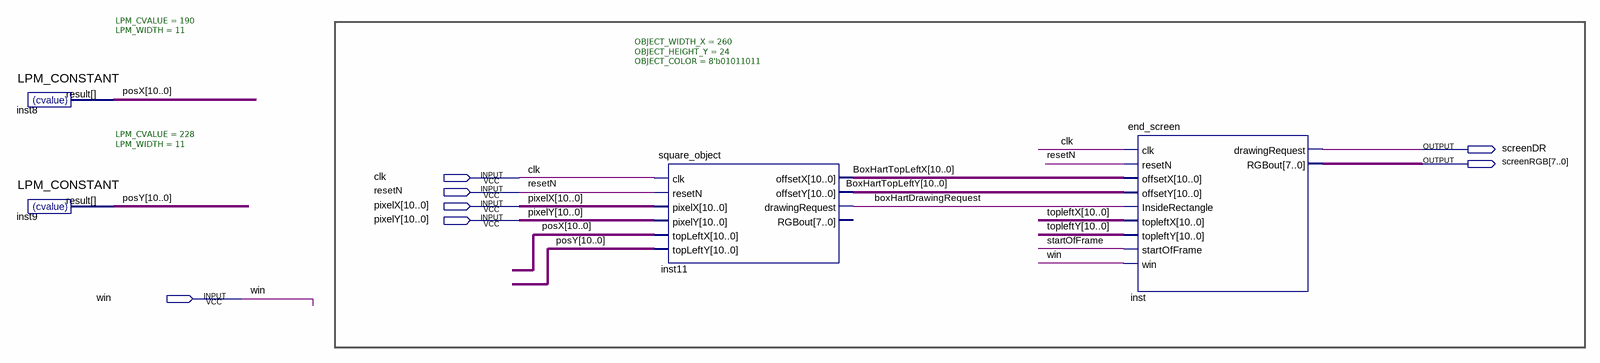
[diagram p0: schematic sheet]
// Quartus schematic END_GAME_SCREEN.bdf as structural Verilog: 4 symbols, 7 pins
module END_GAME_SCREEN (
  input  clk,
  input  resetN,
  input  [10:0] pixelX,
  input  [10:0] pixelY,
  input  win,
  output screenDR,
  output [7:0] screenRGB
);

  wire boxHartDrawingRequest, startOfFrame;
  wire [10:0] BoxHartTopLeftX, BoxHartTopLeftY, posX, posY, topleftX, topleftY;

  LPM_CONSTANT #(.LPM_CVALUE(190), .LPM_WIDTH(11)) inst8 (.result(posX));
  LPM_CONSTANT #(.LPM_CVALUE(228), .LPM_WIDTH(11)) inst9 (.result(posY));
  square_object #(.OBJECT_WIDTH_X(260), .OBJECT_HEIGHT_Y(24), .OBJECT_COLOR(8'b01011011)) inst11 (
    .clk(clk), .resetN(resetN), .pixelX(pixelX), .pixelY(pixelY), .topLeftX(posX), .topLeftY(posY),
    .offsetX(BoxHartTopLeftX), .offsetY(BoxHartTopLeftY), .drawingRequest(boxHartDrawingRequest));  // open: RGBout
  end_screen inst (
    .clk(clk), .resetN(resetN), .offsetX(BoxHartTopLeftX), .offsetY(BoxHartTopLeftY),
    .InsideRectangle(boxHartDrawingRequest), .topleftX(topleftX), .topleftY(topleftY),
    .startOfFrame(startOfFrame), .win(win), .drawingRequest(screenDR), .RGBout(screenRGB));
endmodule
